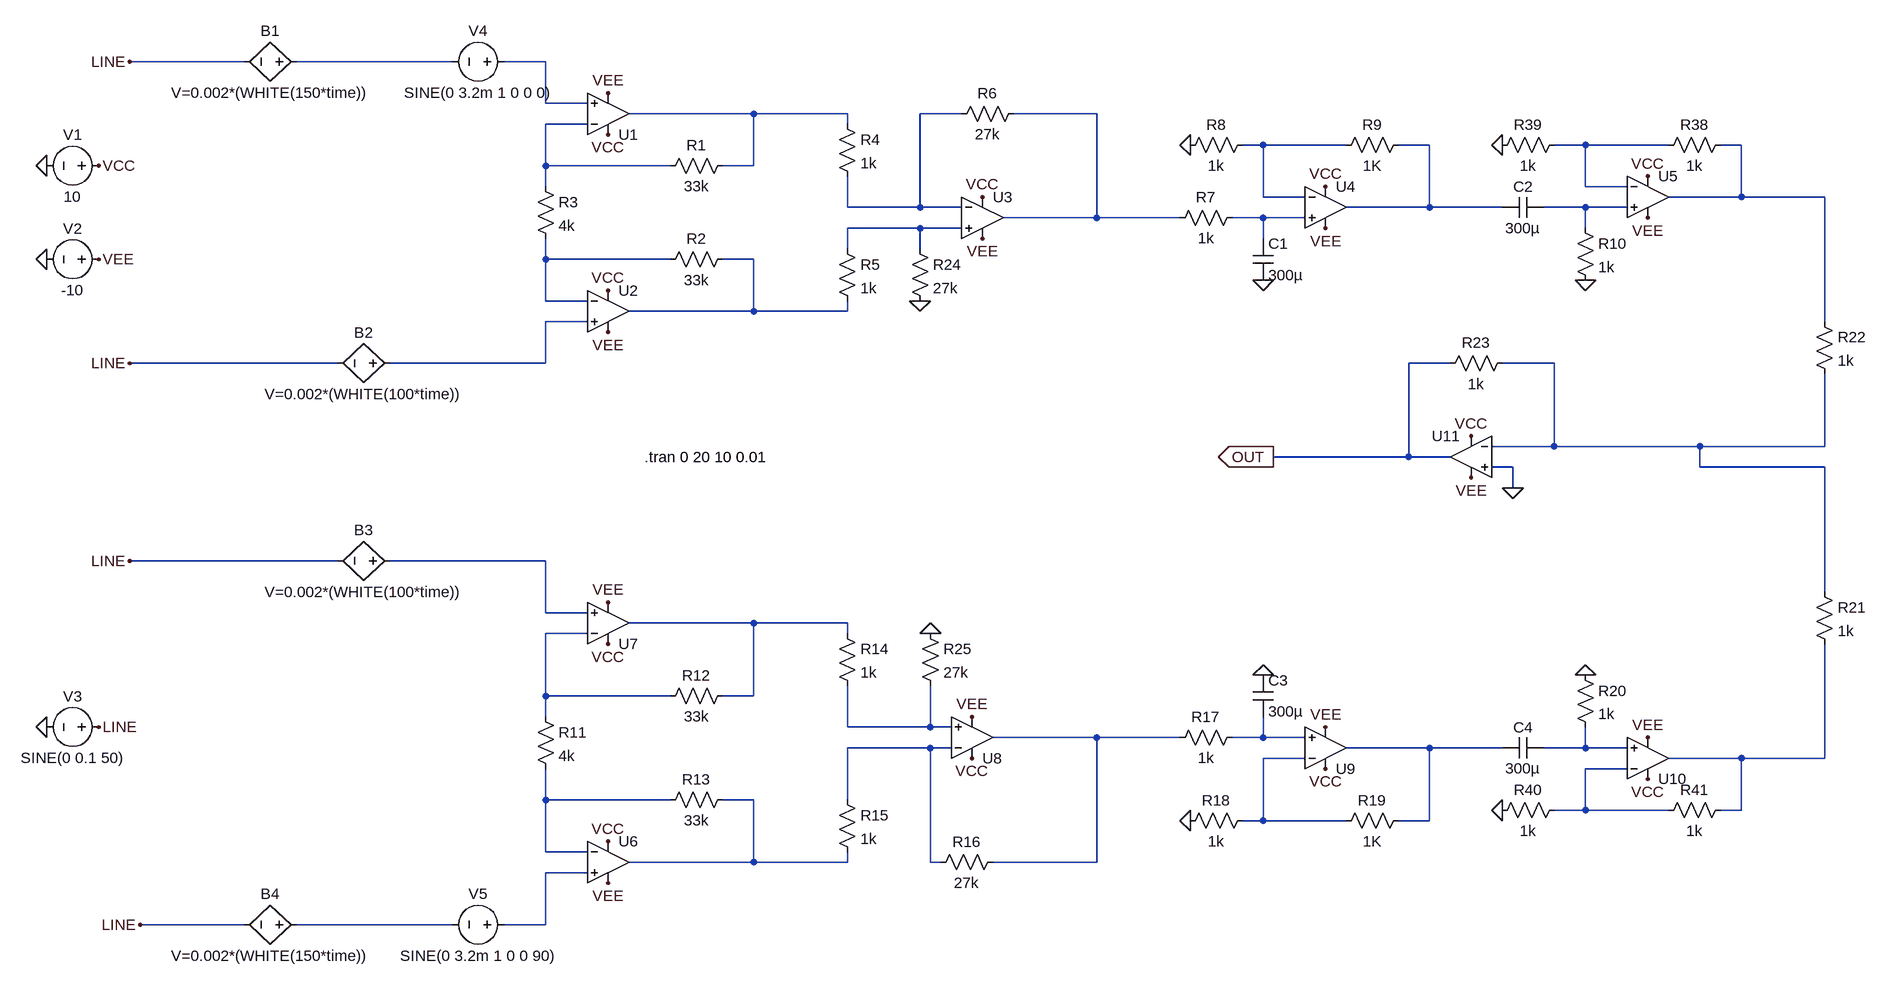
[diagram p0: schematic S&M_Project.asc]
S&M_Project.asc, the LTspice schematic file:
Version 4
SHEET 1 3572 1908
WIRE 576 144 400 144
WIRE 896 144 656 144
WIRE 1040 144 976 144
WIRE 1040 208 1040 144
WIRE 1104 208 1040 208
WIRE 1360 224 1168 224
WIRE 1504 224 1360 224
WIRE 1680 224 1616 224
WIRE 1888 224 1760 224
WIRE 1104 240 1040 240
WIRE 1504 240 1504 224
WIRE 2144 272 2112 272
WIRE 2272 272 2144 272
WIRE 2400 272 2352 272
WIRE 2640 272 2592 272
WIRE 2768 272 2640 272
WIRE 2880 272 2848 272
WIRE 1040 304 1040 240
WIRE 1232 304 1040 304
WIRE 1360 304 1360 224
WIRE 1360 304 1312 304
WIRE 1040 336 1040 304
WIRE 2640 336 2640 272
WIRE 2704 336 2640 336
WIRE 2144 352 2144 272
WIRE 2208 352 2144 352
WIRE 2880 352 2880 272
WIRE 2880 352 2768 352
WIRE 3008 352 2880 352
WIRE 1504 368 1504 320
WIRE 1616 368 1616 224
WIRE 1616 368 1504 368
WIRE 1680 368 1616 368
WIRE 2400 368 2400 272
WIRE 2400 368 2272 368
WIRE 2512 368 2400 368
WIRE 2640 368 2576 368
WIRE 2704 368 2640 368
WIRE 1888 384 1888 224
WIRE 1888 384 1744 384
WIRE 2016 384 1888 384
WIRE 2144 384 2096 384
WIRE 2208 384 2144 384
WIRE 1616 400 1504 400
WIRE 1680 400 1616 400
WIRE 2640 400 2640 368
WIRE 2144 416 2144 384
WIRE 1504 432 1504 400
WIRE 1616 432 1616 400
WIRE 1040 448 1040 416
WIRE 1232 448 1040 448
WIRE 1360 448 1312 448
WIRE 1040 512 1040 448
WIRE 1104 512 1040 512
WIRE 1360 528 1360 448
WIRE 1360 528 1168 528
WIRE 1504 528 1504 512
WIRE 1504 528 1360 528
WIRE 1104 544 1040 544
WIRE 3008 544 3008 352
WIRE 720 608 400 608
WIRE 1040 608 1040 544
WIRE 1040 608 800 608
WIRE 2432 608 2368 608
WIRE 2592 608 2512 608
WIRE 2592 736 2592 608
WIRE 2592 736 2496 736
WIRE 2816 736 2592 736
WIRE 3008 736 3008 624
WIRE 3008 736 2816 736
WIRE 2368 752 2368 608
WIRE 2368 752 2160 752
WIRE 2432 752 2368 752
WIRE 2528 768 2496 768
WIRE 2816 768 2816 736
WIRE 3008 768 2816 768
WIRE 2528 800 2528 768
WIRE 720 912 400 912
WIRE 1040 912 800 912
WIRE 3008 960 3008 768
WIRE 1040 992 1040 912
WIRE 1104 992 1040 992
WIRE 1360 1008 1168 1008
WIRE 1504 1008 1360 1008
WIRE 1104 1024 1040 1024
WIRE 1504 1024 1504 1008
WIRE 1040 1120 1040 1024
WIRE 1232 1120 1040 1120
WIRE 1360 1120 1360 1008
WIRE 1360 1120 1312 1120
WIRE 1040 1152 1040 1120
WIRE 1504 1168 1504 1104
WIRE 1632 1168 1632 1104
WIRE 1632 1168 1504 1168
WIRE 1664 1168 1632 1168
WIRE 1888 1184 1728 1184
WIRE 2016 1184 1888 1184
WIRE 2144 1184 2144 1152
WIRE 2144 1184 2096 1184
WIRE 2208 1184 2144 1184
WIRE 1632 1200 1504 1200
WIRE 1664 1200 1632 1200
WIRE 2400 1200 2272 1200
WIRE 2512 1200 2400 1200
WIRE 2640 1200 2640 1168
WIRE 2640 1200 2576 1200
WIRE 2704 1200 2640 1200
WIRE 2208 1216 2144 1216
WIRE 2880 1216 2768 1216
WIRE 3008 1216 3008 1040
WIRE 3008 1216 2880 1216
WIRE 2704 1232 2640 1232
WIRE 1040 1280 1040 1232
WIRE 1232 1280 1040 1280
WIRE 1360 1280 1312 1280
WIRE 1504 1280 1504 1200
WIRE 2640 1296 2640 1232
WIRE 2640 1296 2592 1296
WIRE 2768 1296 2640 1296
WIRE 2880 1296 2880 1216
WIRE 2880 1296 2848 1296
WIRE 2144 1312 2144 1216
WIRE 2144 1312 2112 1312
WIRE 2272 1312 2144 1312
WIRE 2400 1312 2400 1200
WIRE 2400 1312 2352 1312
WIRE 1040 1360 1040 1280
WIRE 1104 1360 1040 1360
WIRE 1360 1376 1360 1280
WIRE 1360 1376 1168 1376
WIRE 1504 1376 1504 1360
WIRE 1504 1376 1360 1376
WIRE 1632 1376 1632 1200
WIRE 1648 1376 1632 1376
WIRE 1888 1376 1888 1184
WIRE 1888 1376 1728 1376
WIRE 1104 1392 1040 1392
WIRE 576 1472 416 1472
WIRE 896 1472 656 1472
WIRE 1040 1472 1040 1392
WIRE 1040 1472 976 1472
FLAG 400 144 LINE
FLAG 1136 256 VCC
FLAG 1136 192 VEE
FLAG 400 608 LINE
FLAG 1712 352 VCC
FLAG 1136 496 VCC
FLAG 1712 416 VEE
FLAG 1136 560 VEE
FLAG 416 1472 LINE
FLAG 400 912 LINE
FLAG 2528 800 0
FLAG 2160 752 OUT
IOPIN 2160 752 Out
FLAG 2464 720 VCC
FLAG 1696 1216 VCC
FLAG 1136 1344 VCC
FLAG 1136 1040 VCC
FLAG 2464 784 VEE
FLAG 1696 1152 VEE
FLAG 1136 976 VEE
FLAG 1136 1408 VEE
FLAG 1616 512 0
FLAG 1632 1024 0
FLAG 2032 272 0
FLAG 2144 480 0
FLAG 2512 272 0
FLAG 2640 480 0
FLAG 2144 1088 0
FLAG 2032 1312 0
FLAG 2640 1088 0
FLAG 2512 1296 0
FLAG 2240 336 VCC
FLAG 2736 320 VCC
FLAG 2736 1248 VCC
FLAG 2240 1232 VCC
FLAG 2240 1168 VEE
FLAG 2736 1184 VEE
FLAG 2736 384 VEE
FLAG 2240 400 VEE
FLAG 272 304 0
FLAG 352 304 VCC
FLAG 272 448 0
FLAG 352 448 VEE
FLAG 272 1168 0
FLAG 352 1168 LINE
SYMBOL res 1024 320 R0
SYMATTR InstName R3
SYMATTR Value 4k
SYMBOL bv 672 144 R90
WINDOW 0 -32 56 VBottom 2
WINDOW 3 32 56 VTop 2
SYMATTR InstName B1
SYMATTR Value V=0.002*(WHITE(150*time))
SYMBOL voltage 992 144 R90
WINDOW 0 -32 56 VBottom 2
WINDOW 3 32 56 VTop 2
WINDOW 123 0 0 Left 0
WINDOW 39 0 0 Left 0
SYMATTR InstName V4
SYMATTR Value SINE(0 3.2m 1 0 0 0)
SYMBOL bv 816 608 R90
WINDOW 0 -32 56 VBottom 2
WINDOW 3 32 56 VTop 2
SYMATTR InstName B2
SYMATTR Value V=0.002*(WHITE(100*time))
SYMBOL res 1328 288 R90
WINDOW 0 0 56 VBottom 2
WINDOW 3 32 56 VTop 2
SYMATTR InstName R1
SYMATTR Value 33k
SYMBOL res 1328 432 R90
WINDOW 0 0 56 VBottom 2
WINDOW 3 32 56 VTop 2
SYMATTR InstName R2
SYMATTR Value 33k
SYMBOL res 1488 224 R0
SYMATTR InstName R4
SYMATTR Value 1k
SYMBOL res 1488 416 R0
SYMATTR InstName R5
SYMATTR Value 1k
SYMBOL res 1776 208 R90
WINDOW 0 0 56 VBottom 2
WINDOW 3 32 56 VTop 2
SYMATTR InstName R6
SYMATTR Value 27k
SYMBOL bv 816 912 R90
WINDOW 0 -32 56 VBottom 2
WINDOW 3 32 56 VTop 2
SYMATTR InstName B3
SYMATTR Value V=0.002*(WHITE(100*time))
SYMBOL res 1024 1136 R0
SYMATTR InstName R11
SYMATTR Value 4k
SYMBOL bv 672 1472 R90
WINDOW 0 -32 56 VBottom 2
WINDOW 3 32 56 VTop 2
SYMATTR InstName B4
SYMATTR Value V=0.002*(WHITE(150*time))
SYMBOL voltage 992 1472 R90
WINDOW 0 -32 56 VBottom 2
WINDOW 3 32 56 VTop 2
WINDOW 123 0 0 Left 0
WINDOW 39 0 0 Left 0
SYMATTR InstName V5
SYMATTR Value SINE(0 3.2m 1 0 0 90)
SYMBOL res 1328 1104 R90
WINDOW 0 0 56 VBottom 2
WINDOW 3 32 56 VTop 2
SYMATTR InstName R12
SYMATTR Value 33k
SYMBOL res 1328 1264 R90
WINDOW 0 0 56 VBottom 2
WINDOW 3 32 56 VTop 2
SYMATTR InstName R13
SYMATTR Value 33k
SYMBOL res 1488 1008 R0
SYMATTR InstName R14
SYMATTR Value 1k
SYMBOL res 1488 1264 R0
SYMATTR InstName R15
SYMATTR Value 1k
SYMBOL res 1744 1360 R90
WINDOW 0 0 56 VBottom 2
WINDOW 3 32 56 VTop 2
SYMATTR InstName R16
SYMATTR Value 27k
SYMBOL res 2992 944 R0
SYMATTR InstName R21
SYMATTR Value 1k
SYMBOL res 2992 528 R0
SYMATTR InstName R22
SYMATTR Value 1k
SYMBOL res 2528 592 R90
WINDOW 0 0 56 VBottom 2
WINDOW 3 32 56 VTop 2
SYMATTR InstName R23
SYMATTR Value 1k
SYMBOL res 1600 416 R0
SYMATTR InstName R24
SYMATTR Value 27k
SYMBOL res 1616 1008 R0
SYMATTR InstName R25
SYMATTR Value 27k
SYMBOL OpAmps\\UniversalOpamp2 1136 224 M180
SYMATTR InstName U1
SYMBOL OpAmps\\UniversalOpamp2 1136 528 R0
SYMATTR InstName U2
SYMBOL OpAmps\\UniversalOpamp2 1712 384 R0
SYMATTR InstName U3
SYMBOL OpAmps\\UniversalOpamp2 2464 752 M0
SYMATTR InstName U11
SYMBOL OpAmps\\UniversalOpamp2 1136 1376 R0
SYMATTR InstName U6
SYMBOL OpAmps\\UniversalOpamp2 1136 1008 M180
SYMATTR InstName U7
SYMBOL OpAmps\\UniversalOpamp2 1696 1184 M180
SYMATTR InstName U8
SYMBOL res 2112 368 R90
WINDOW 0 0 56 VBottom 2
WINDOW 3 32 56 VTop 2
SYMATTR InstName R7
SYMATTR Value 1k
SYMBOL cap 2128 416 R0
SYMATTR InstName C1
SYMATTR Value 300µ
SYMBOL OpAmps\\UniversalOpamp2 2240 368 R0
SYMATTR InstName U4
SYMBOL res 2128 256 R90
WINDOW 0 0 56 VBottom 2
WINDOW 3 32 56 VTop 2
SYMATTR InstName R8
SYMATTR Value 1k
SYMBOL cap 2576 352 R90
WINDOW 0 0 32 VBottom 2
WINDOW 3 32 32 VTop 2
SYMATTR InstName C2
SYMATTR Value 300µ
SYMBOL res 2624 384 R0
SYMATTR InstName R10
SYMATTR Value 1k
SYMBOL OpAmps\\UniversalOpamp2 2736 352 R0
SYMATTR InstName U5
SYMBOL res 2864 256 R90
WINDOW 0 0 56 VBottom 2
WINDOW 3 32 56 VTop 2
SYMATTR InstName R38
SYMATTR Value 1k
SYMBOL res 2608 256 R90
WINDOW 0 0 56 VBottom 2
WINDOW 3 32 56 VTop 2
SYMATTR InstName R39
SYMATTR Value 1k
SYMBOL res 2112 1168 R90
WINDOW 0 0 56 VBottom 2
WINDOW 3 32 56 VTop 2
SYMATTR InstName R17
SYMATTR Value 1k
SYMBOL cap 2128 1088 R0
SYMATTR InstName C3
SYMATTR Value 300µ
SYMBOL OpAmps\\UniversalOpamp2 2240 1200 M180
SYMATTR InstName U9
SYMBOL res 2128 1296 R90
WINDOW 0 0 56 VBottom 2
WINDOW 3 32 56 VTop 2
SYMATTR InstName R18
SYMATTR Value 1k
SYMBOL cap 2576 1184 R90
WINDOW 0 0 32 VBottom 2
WINDOW 3 32 32 VTop 2
SYMATTR InstName C4
SYMATTR Value 300µ
SYMBOL res 2624 1072 R0
SYMATTR InstName R20
SYMATTR Value 1k
SYMBOL res 2608 1280 R90
WINDOW 0 0 56 VBottom 2
WINDOW 3 32 56 VTop 2
SYMATTR InstName R40
SYMATTR Value 1k
SYMBOL res 2864 1280 R90
WINDOW 0 0 56 VBottom 2
WINDOW 3 32 56 VTop 2
SYMATTR InstName R41
SYMATTR Value 1k
SYMBOL OpAmps\\UniversalOpamp2 2736 1216 M180
SYMATTR InstName U10
SYMBOL voltage 368 304 R90
WINDOW 0 -32 56 VBottom 2
WINDOW 3 32 56 VTop 2
SYMATTR InstName V1
SYMATTR Value 10
SYMBOL voltage 368 448 R90
WINDOW 0 -32 56 VBottom 2
WINDOW 3 32 56 VTop 2
SYMATTR InstName V2
SYMATTR Value -10
SYMBOL voltage 368 1168 R90
WINDOW 0 -32 56 VBottom 2
WINDOW 3 32 56 VTop 2
SYMATTR InstName V3
SYMATTR Value SINE(0 0.1 50)
SYMBOL res 2368 256 R90
WINDOW 0 0 56 VBottom 2
WINDOW 3 32 56 VTop 2
SYMATTR InstName R9
SYMATTR Value 1K
SYMBOL res 2368 1296 R90
WINDOW 0 0 56 VBottom 2
WINDOW 3 32 56 VTop 2
SYMATTR InstName R19
SYMATTR Value 1K
TEXT 1192 752 Left 2 !.tran 0 20 10 0.01

The netlist it stands for:
* S&M_Project.asc
R3 N006 N014 4k
B1 N001 LINE V=0.002*(WHITE(150*time))
V4 N002 N001 SINE(0 3.2m 1 0 0 0)
B2 N016 LINE V=0.002*(WHITE(100*time))
R1 N003 N006 33k
R2 N015 N014 33k
R4 N003 N004 1k
R5 N013 N015 1k
R6 N005 N004 27k
B3 N018 LINE V=0.002*(WHITE(100*time))
R11 N020 N030 4k
B4 N033 LINE V=0.002*(WHITE(150*time))
V5 N032 N033 SINE(0 3.2m 1 0 0 90)
R12 N019 N020 33k
R13 N031 N030 33k
R14 N019 N021 1k
R15 N024 N031 1k
R16 N022 N024 27k
R21 N017 N028 1k
R22 N010 N017 1k
R23 N017 OUT 1k
R24 N013 0 27k
R25 0 N021 27k
XU1 N002 N006 VCC VEE N003 level.2 Avol=1Meg GBW=10Meg Slew=10Meg ilimit=25m rail=0 Vos=0 phimargin=45 en=0 enk=0 in=0 ink=0 Rin=500Meg  ; pins IN+ IN- V+ V- OUT
XU2 N016 N014 VCC VEE N015 level.2 Avol=1Meg GBW=10Meg Slew=10Meg ilimit=25m rail=0 Vos=0 phimargin=45 en=0 enk=0 in=0 ink=0 Rin=500Meg  ; pins IN+ IN- V+ V- OUT
XU3 N013 N004 VCC VEE N005 level.2 Avol=1Meg GBW=10Meg Slew=10Meg ilimit=25m rail=0 Vos=0 phimargin=45 en=0 enk=0 in=0 ink=0 Rin=500Meg  ; pins IN+ IN- V+ V- OUT
XU11 0 N017 VCC VEE OUT level.2 Avol=1Meg GBW=10Meg Slew=10Meg ilimit=25m rail=0 Vos=0 phimargin=45 en=0 enk=0 in=0 ink=0 Rin=500Meg  ; pins IN+ IN- V+ V- OUT
XU6 N032 N030 VCC VEE N031 level.2 Avol=1Meg GBW=10Meg Slew=10Meg ilimit=25m rail=0 Vos=0 phimargin=45 en=0 enk=0 in=0 ink=0 Rin=500Meg  ; pins IN+ IN- V+ V- OUT
XU7 N018 N020 VCC VEE N019 level.2 Avol=1Meg GBW=10Meg Slew=10Meg ilimit=25m rail=0 Vos=0 phimargin=45 en=0 enk=0 in=0 ink=0 Rin=500Meg  ; pins IN+ IN- V+ V- OUT
XU8 N021 N024 VCC VEE N022 level.2 Avol=1Meg GBW=10Meg Slew=10Meg ilimit=25m rail=0 Vos=0 phimargin=45 en=0 enk=0 in=0 ink=0 Rin=500Meg  ; pins IN+ IN- V+ V- OUT
R7 N012 N005 1k
C1 N012 0 300µ
XU4 N012 N007 VCC VEE N008 level.2 Avol=1Meg GBW=10Meg Slew=10Meg ilimit=25m rail=0 Vos=0 phimargin=45 en=0 enk=0 in=0 ink=0 Rin=500Meg  ; pins IN+ IN- V+ V- OUT
R8 N007 0 1k
C2 N011 N008 300µ
R10 N011 0 1k
XU5 N011 N009 VCC VEE N010 level.2 Avol=1Meg GBW=10Meg Slew=10Meg ilimit=25m rail=0 Vos=0 phimargin=45 en=0 enk=0 in=0 ink=0 Rin=500Meg  ; pins IN+ IN- V+ V- OUT
R38 N010 N009 1k
R39 N009 0 1k
R17 N023 N022 1k
C3 0 N023 300µ
XU9 N023 N027 VCC VEE N025 level.2 Avol=1Meg GBW=10Meg Slew=10Meg ilimit=25m rail=0 Vos=0 phimargin=45 en=0 enk=0 in=0 ink=0 Rin=500Meg  ; pins IN+ IN- V+ V- OUT
R18 N027 0 1k
C4 N026 N025 300µ
R20 0 N026 1k
R40 N029 0 1k
R41 N028 N029 1k
XU10 N026 N029 VCC VEE N028 level.2 Avol=1Meg GBW=10Meg Slew=10Meg ilimit=25m rail=0 Vos=0 phimargin=45 en=0 enk=0 in=0 ink=0 Rin=500Meg  ; pins IN+ IN- V+ V- OUT
V1 VCC 0 10
V2 VEE 0 -10
V3 LINE 0 SINE(0 0.1 50)
R9 N008 N007 1K
R19 N025 N027 1K
.tran 0 20 10 0.01
.lib UniversalOpamps2.sub
.backanno
.end